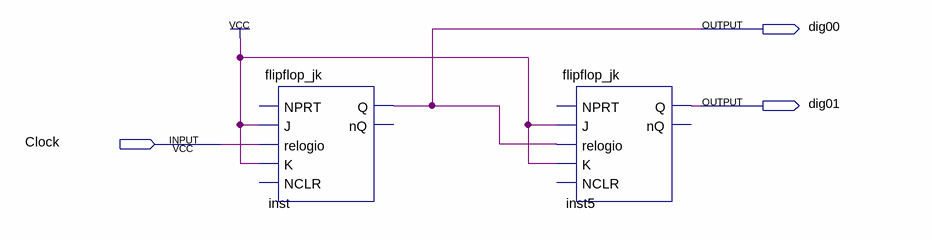
[diagram p0: schematic sheet]
// Quartus schematic contador_de_doido.bdf as structural Verilog: 2 symbols, 3 pins
module contador_de_doido (
  input  Clock,
  output dig00,
  output dig01
);

  flipflop_jk inst (.J(1'b1), .relogio(Clock), .K(1'b1), .Q(dig00));  // open: NPRT, NCLR, nQ
  flipflop_jk inst5 (.J(1'b1), .relogio(dig00), .K(1'b1), .Q(dig01));  // open: NPRT, NCLR, nQ
endmodule
